# Altium schematic sheet main.SchDoc
size A4; Engineer: Amir Hossein Jobeiri; Organization: Simaran; SheetNumber: 1; SheetTotal: 25
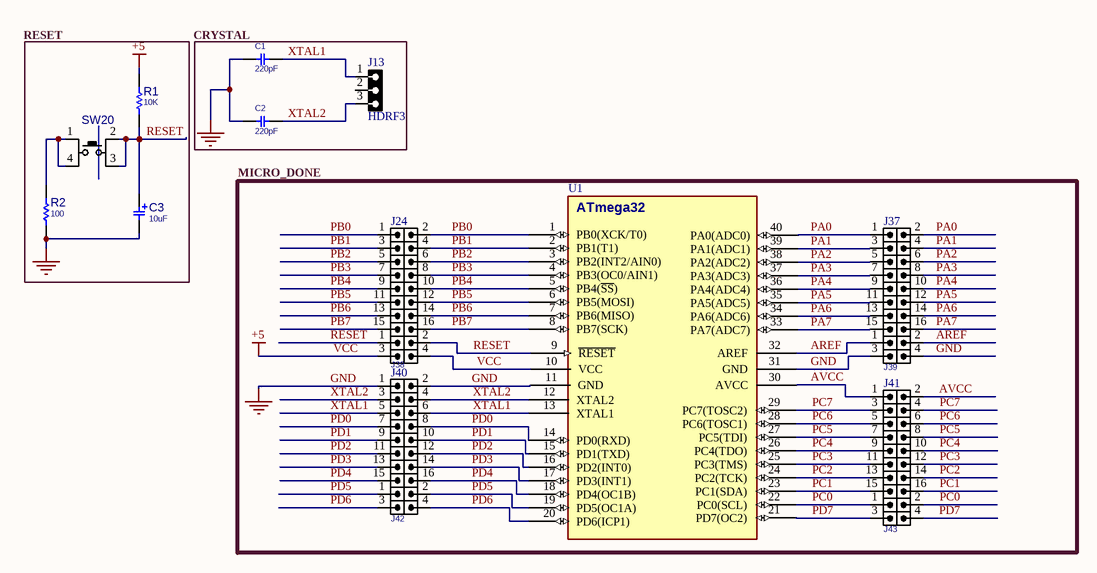
[diagram p0: main.SchDoc]

## Parts
C1  220pF  [C_CER_D3]
C2  220pF  [C_CER_D3]
C3  10uF  [C_EL_8X12]
J13  HDRF3  [HDR_F_1X3]
J24  HDRM_2X8  [HDR_M_2X8]  (value not drawn)
J37  HDRM_2X8  [HDR_M_2X8]  (value not drawn)
J38  HDRM_2X2  [HDR_M_2X2]  (value not drawn)
J39  HDRM_2X2  [HDR_M_2X2]  (value not drawn)
J40  HDRM_2X8  [HDR_M_2X8]  (value not drawn)
J41  HDRM_2X8  [HDR_M_2X8]  (value not drawn)
J42  HDRM_2X2  [HDR_M_2X2]  (value not drawn)
J43  HDRM_2X2  [HDR_M_2X2]  (value not drawn)
R1  10K  [R025W_AX04]
R2  100  [R025W_AX04]
SW20  PUSHBUTTON  [SWPBT_SPDT_6X6X5]  (value not drawn)
U1  ATMEGA32  [DIP_40DW]  (value not drawn)

## Blocks framed on the sheet
RESET: C3 R1 R2 SW20
CRYSTAL: C1 C2 J13
MICRO_DONE: J24 J37-J43 U1

## Nets
GND: C1.2 C2.2 C3.2 J39.3 J39.4 J40.1 J40.2 R2.1 U1.11(GND) U1.31(GND)
VCC: J38.3 J38.4 R1.2 U1.10(VCC)  [also labelled +5]
AREF: J39.1 J39.2 U1.32(AREF)
AVCC: J41.1 J41.2 U1.30(AVCC)
PA0: J37.1 J37.2 U1.40(PA0(ADC0))
PA1: J37.3 J37.4 U1.39(PA1(ADC1))
PA2: J37.5 J37.6 U1.38(PA2(ADC2))
PA3: J37.7 J37.8 U1.37(PA3(ADC3))
PA4: J37.9 J37.10 U1.36(PA4(ADC4))
PA5: J37.11 J37.12 U1.35(PA5(ADC5))
PA6: J37.13 J37.14 U1.34(PA6(ADC6))
PA7: J37.15 J37.16 U1.33(PA7(ADC7))
PB0: J24.1 J24.2 U1.1(PB0(XCK/T0))
PB1: J24.3 J24.4 U1.2(PB1(T1))
PB2: J24.5 J24.6 U1.3(PB2(INT2/AIN0))
PB3: J24.7 J24.8 U1.4(PB3(OC0/AIN1))
PB4: J24.9 J24.10 U1.5(PB4(~{SS}))
PB5: J24.11 J24.12 U1.6(PB5(MOSI))
PB6: J24.13 J24.14 U1.7(PB6(MISO))
PB7: J24.15 J24.16 U1.8(PB7(SCK))
PC0: J43.1 J43.2 U1.22(PC0(SCL))
PC1: J41.15 J41.16 U1.23(PC1(SDA))
PC2: J41.13 J41.14 U1.24(PC2(TCK))
PC3: J41.11 J41.12 U1.25(PC3(TMS))
PC4: J41.9 J41.10 U1.26(PC4(TDO))
PC5: J41.7 J41.8 U1.27(PC5(TDI))
PC6: J41.5 J41.6 U1.28(PC6(TOSC1))
PC7: J41.3 J41.4 U1.29(PC7(TOSC2))
PD0: J40.7 J40.8 U1.14(PD0(RXD))
PD1: J40.9 J40.10 U1.15(PD1(TXD))
PD2: J40.11 J40.12 U1.16(PD2(INT0))
PD3: J40.13 J40.14 U1.17(PD3(INT1))
PD4: J40.15 J40.16 U1.18(PD4(OC1B))
PD5: J42.1 J42.2 U1.19(PD5(OC1A))
PD6: J42.3 J42.4 U1.20(PD6(ICP1))
PD7: J43.3 J43.4 U1.21(PD7(OC2))
RESET: C3.1 J38.1 J38.2 R1.1 SW20.2(P3) SW20.3(P4) U1.9(~{RESET})
XTAL1: C1.1 J13.1 J40.5 J40.6 U1.13(XTAL1)
XTAL2: C2.1 J13.3 J40.3 J40.4 U1.12(XTAL2)
NetR2_2: R2.2 SW20.1(P1) SW20.4(P2)

Not connected (* = marked no-connect by the designer): J13 2

## Notes on the sheet
- (in symbol ATMEGA32A_DIP40) ATmega32

## Library data of the parts
C1 C2 = CAP_THD_CERML: CAP, THD, CER MULTI LAYER,; PARAM: 50V; DESC: CAP, CER MULTI LAYER,; MANF_P#: MANF_PART#; PRICE: 100= 1$; MANF: MANF; PARAM2: PARAM2; ASSEMBLY: ASSEMBLY; VALUE: 220pF
C3 = CAP_THD_EL: CAP, THD, ELEC,; MANF_P#: MANF_PART#; PARAM2: 25V; DESC: DESCRIPTION; DIST#: MOUSER; PARAM: 20%; PRICE: 10= 5$; MANF: MANF; ASSEMBLY: ASSEMBLY; VALUE: 10uF
J13 = HDR_F_1X3: CONN, HEADER, Female, pitch: 2.54mm, 3POS; VALUE: HDRF3
J24 J37 J40 J41 = HDR_M_2X8: CONN, HEADER, Male, pitch: 2.54mm, 16POS; VALUE: HDRM_2X8
J38 J39 J42 J43 = HDR_M_2X2: CONN, HEADER, Male, pitch: 2.54mm, 4POS; MANF_P#: MANF_PART#; MANF: MANF; VALUE: HDRM_2X2
R1 R2 = RES_THD: RESISTOR, THD; MANF_P#: RK73H1ETTP4701F; MANF: KOA SPEER; PARAM: 0.063W; DESC: DESCRIPTION; DIST#: MOUSER; PARAM2: 1%; ASSEMBLY: ASSEMBLY; PRICE: 100= 0.5$
  R1: VALUE: 10K
  R2: VALUE: 100
SW20 = SWPBT_SPDT_6X6X5: SWITCH, PUSH BUTTON, TACTILE, THD, SPDT, 4X4MM; DESC: DESCRIPTION; MANF: -; VALUE: PUSHBUTTON; ASSEMBLY: ASSEMBLY; PARAM: PARAM; PRICE: PRICE; MANF_P#: -
U1 = ATMEGA32A_DIP40: MCU, AVR, 8-Bit, 32KB, 2KB RAM, 16MHz; MANF_P#: ATMEGA32A-PU; DESC: 1KB EEPROM; MANF: ATMEL/MICROCHIP; PARAM2: 2.7~5.5V; PARAM: 32KB, 2KB RAM, 16MHz, -40~85°C; PRICE: 3.5$; VALUE: ATMEGA32